# EAGLE design VolumePot (EAGLE 7.3.0)
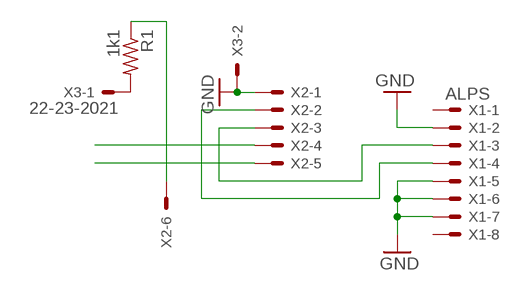
[diagram p0: schematic, sheet 1]

## Parts
R1  1k1  R-US_0309/12  [0309/12]
X1  ALPS  22-23-2081  [22-23-2081]
X2  22-23-2061  [22-23-2061]
X3  22-23-2021  [22-23-2021]

## Nets
CCW: X2.5
CW: X2.4
GND: X1.2 X1.5 X1.6 X1.7 X2.1 X3.2
N$1: R1.2 X3.1
N$2: X1.3 X2.3
N$3: R1.1 X2.6
N$4: X1.4 X2.2
Unconnected: X1.1 X1.8

## Library data of the parts
R1 = resistor:R-US_: RESISTOR, American symbol
X1 = con-molex:22-23-2081: .100" (2.54mm) Center Header - 8 Pin; MF: MOLEX; MPN: 22-23-2081; OC_FARNELL: 1756826; OC_NEWARK: 01C7592
X2 = con-molex:22-23-2061: .100" (2.54mm) Center Header - 6 Pin; MF: MOLEX; MPN: 22-23-2061; OC_FARNELL: 1462922; OC_NEWARK: 27C1933
X3 = con-molex:22-23-2021: .100" (2.54mm) Center Header - 2 Pin; MF: MOLEX; MPN: 22-23-2021; OC_FARNELL: 1462926; OC_NEWARK: 25C3832

## Board
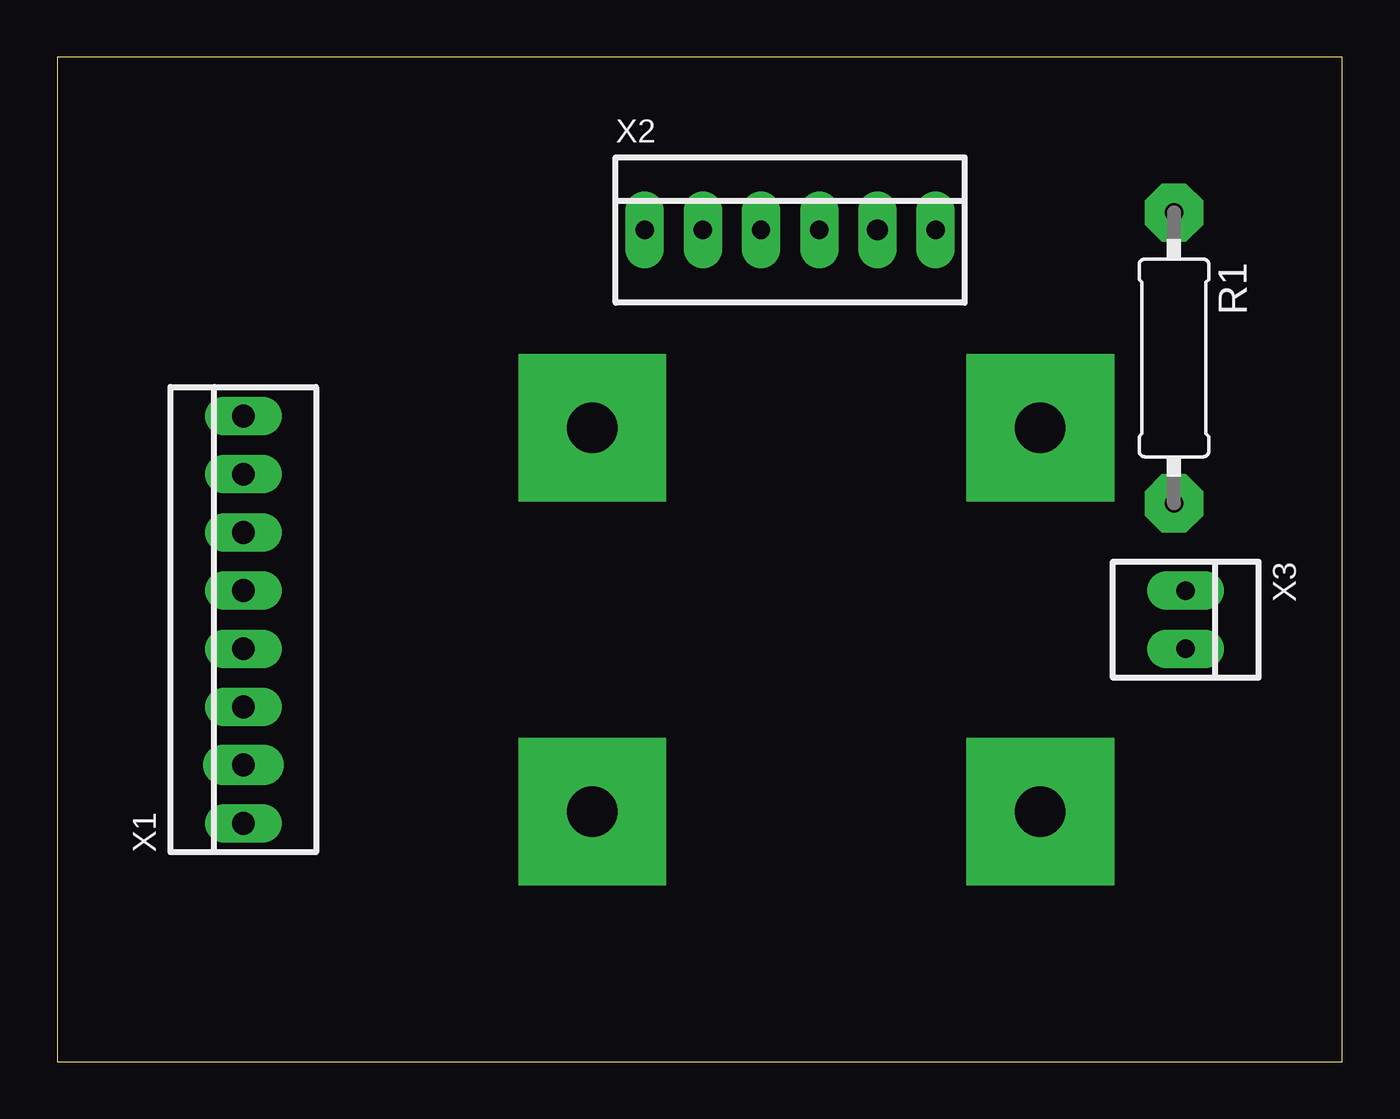
[diagram p1: board, top side]
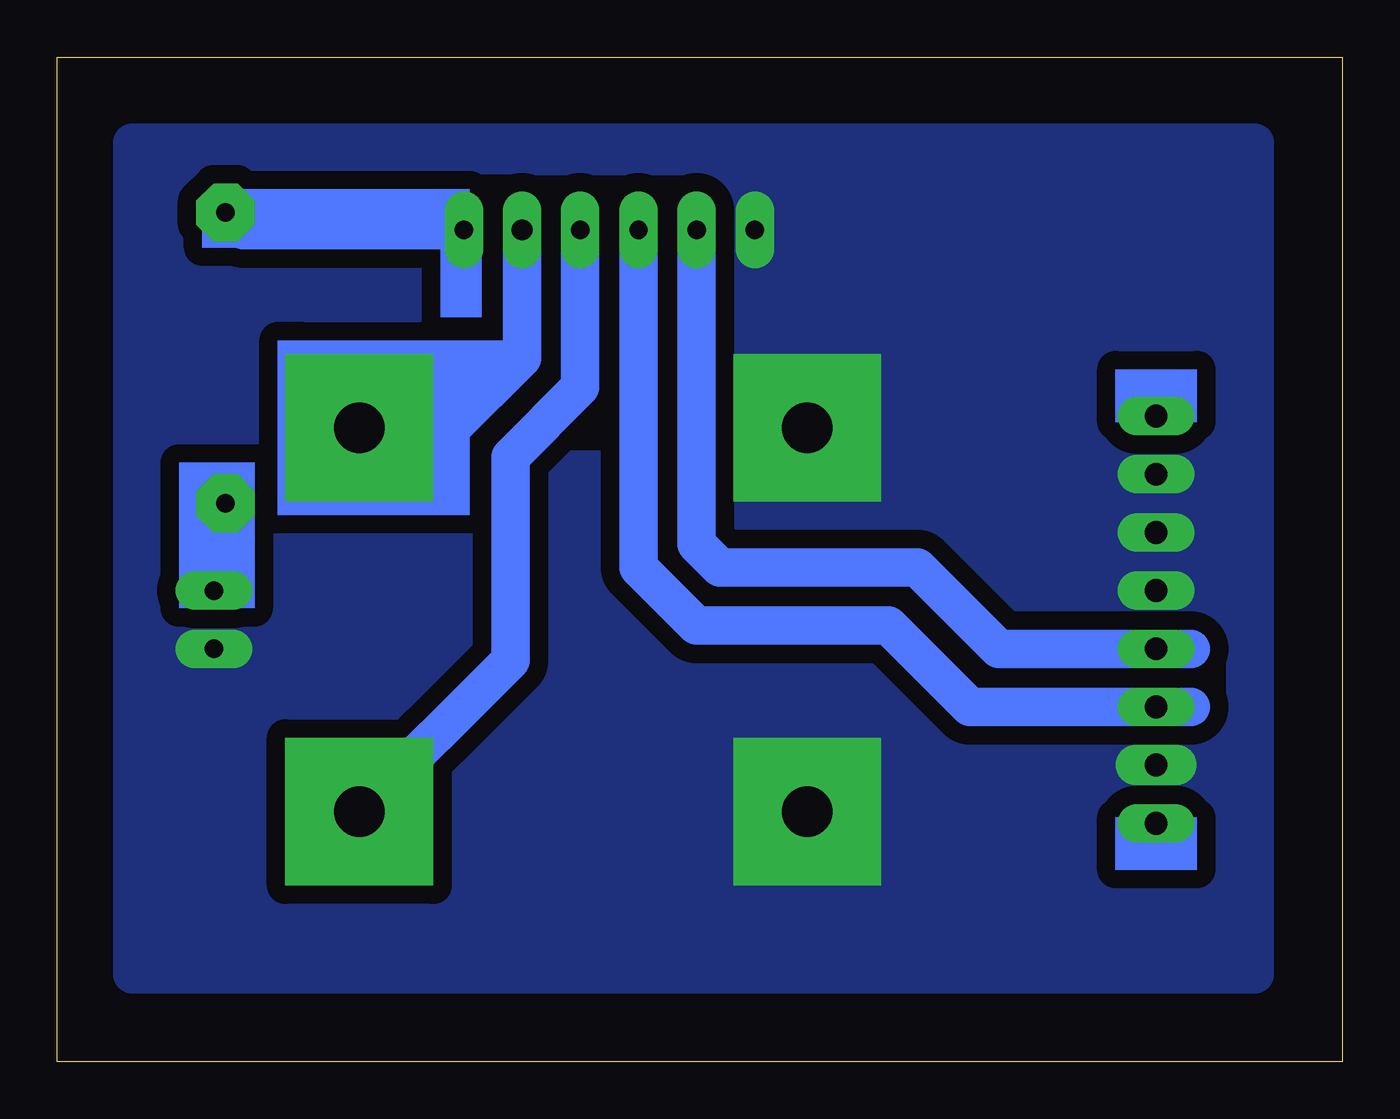
[diagram p2: board, bottom side, seen from below]

Size 56.11 x 43.87 mm. Coordinates in mm from the lower left corner, seen from the top.
Outline: 0,0 56.11,0 56.11,43.87 0,43.87 0,0
Copper layers (1*16): Top 0.035mm / dielectric 1.5mm / Bottom 0.035mm
Design rules "default": minimum track width 10mil, minimum drill 24mil, track to track 8mil, track to pad 8mil, pad to pad 8mil, via to via 8mil, smd to smd 8mil, copper to edge 40mil, drill to drill 8mil, minimum pad ring 10mil, minimum via ring 8mil, stop-mask expansion 4mil, vias tented up to drill 0mil, thermal gap 10mil

### Footprints (pad centres in the part's own frame; a part is rotated, then mirrored left to right if it is on the bottom)
0309/12 = drill 0.813 pad 2.54 octagon: 1 -6.35,0; 2 6.35,0
22-23-2081 = drill 1 pad 1.676 long: 1 -8.89,0; 3 -3.81,0; 4 -1.27,0; 5 1.27,0; 6 3.81,0; 7 6.35,0; 8 8.89,0 | drill 1 pad 1.778 long: 2 -6.35,0
22-23-2061 = drill 0.8 pad 1.676 long: 1 -6.35,0; 2 -3.81,0; 3 -1.27,0; 4 1.27,0; 6 6.35,0 | drill 0.9 pad 1.676 long: 5 3.81,0
22-23-2021 = drill 0.8 pad 1.676 long: 1 -1.27,0; 2 1.27,0

### Placement (x,y rotation side)
R1  48.77,30.73 270 top
X1  8.13,19.3 90 top
X2  32,36.32 0 top
X3  49.28,19.3 270 top

### Tracks (layer width: path | path; a pad name or v marks a point on that pad's centre or on a via)
CCW  (via drill 2.2 pad 6.45)
  Bottom 1.676: v42.93,27.69 38.86,27.69 35.81,30.73 X2.5
CW  (via drill 2.2 pad 6.45)
  Bottom 1.676: v42.93,10.92 36.32,17.53 36.32,26.42 33.27,29.46 X2.4
GND  (via drill 2.2 pad 6.45)
  other vias: 23.37,27.69 23.37,10.92
  pour Bottom (isolate 0.813, no thermals): 3.81,40.13 52.83,40.13 52.83,3.81 3.81,3.81
N$1
  Bottom 1.676: X3.1 48.77,21.08 R1.2
N$2
  Bottom 1.676: 6.6,15.49 X1.3 16.26,15.49 19.81,19.05 28.19,19.05 30.73,21.59 X2.3
N$3
  Bottom 1.676: R1.1 48.01,36.32 X2.6
N$4
  Bottom 1.676: 6.6,18.03 X1.4 14.99,18.03 18.54,21.59 27.18,21.59 28.19,22.61 X2.2
(copper drawn outside any net)
  shapes: Bottom area x12, Bottom circle x2